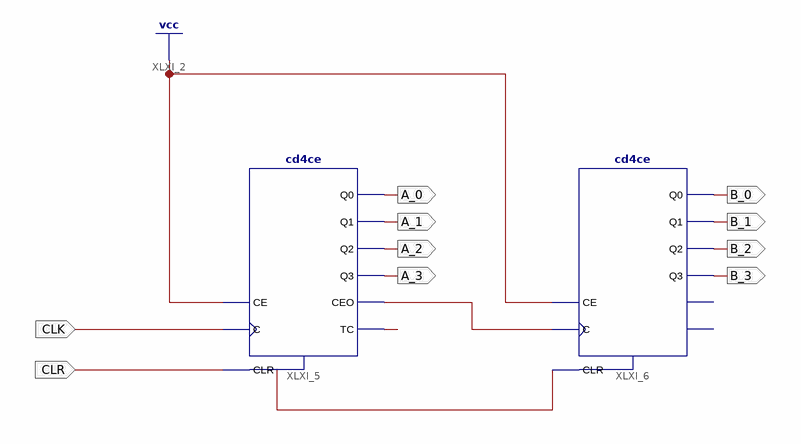
[diagram p0: schematic sheet 1]
// Xilinx ISE schematic counter.sch (spartan6) as structural Verilog: 2 symbols, 10 ports
module counter (
  input  CLK,
  input  CLR,
  output A_0,
  output A_1,
  output A_2,
  output A_3,
  output B_0,
  output B_1,
  output B_2,
  output B_3
);

  wire CEO, TC, XLXN_16;

  cd4ce XLXI_5 (.C(CLK), .CE(1'b1), .CLR(CLR), .CEO(CEO), .Q0(A_0), .Q1(A_1), .Q2(A_2), .Q3(A_3), .TC(TC));
  cd4ce XLXI_6 (.C(CEO), .CE(1'b1), .CLR(XLXN_16), .Q0(B_0), .Q1(B_1), .Q2(B_2), .Q3(B_3));  // open: CEO, TC
endmodule
